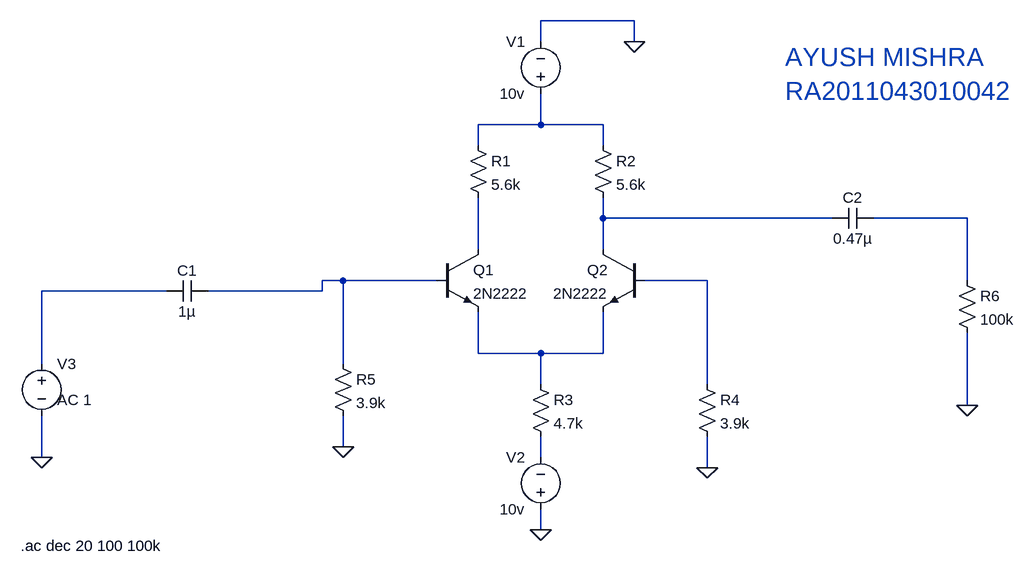
[diagram p0: schematic EXP 6x.asc]
EXP 6x.asc, the LTspice schematic file:
Version 4
SHEET 1 1444 680
WIRE 400 -224 256 -224
WIRE 256 -192 256 -224
WIRE 400 -192 400 -224
WIRE 256 -64 256 -112
WIRE 256 -64 160 -64
WIRE 352 -64 256 -64
WIRE 160 -32 160 -64
WIRE 352 -32 352 -64
WIRE 352 80 352 48
WIRE 704 80 352 80
WIRE 912 80 768 80
WIRE 160 128 160 48
WIRE 352 128 352 80
WIRE -48 176 -80 176
WIRE 96 176 -48 176
WIRE 512 176 416 176
WIRE 912 176 912 80
WIRE -320 192 -512 192
WIRE -80 192 -80 176
WIRE -80 192 -256 192
WIRE 160 288 160 224
WIRE 256 288 160 288
WIRE 352 288 352 224
WIRE 352 288 256 288
WIRE -512 304 -512 192
WIRE -48 304 -48 176
WIRE 256 336 256 288
WIRE 512 336 512 176
WIRE 912 368 912 256
WIRE -48 432 -48 384
WIRE -512 448 -512 384
WIRE 256 448 256 416
WIRE 512 464 512 416
WIRE 256 560 256 528
FLAG 400 -192 0
FLAG 256 560 0
FLAG -48 432 0
FLAG 512 464 0
FLAG -512 448 0
FLAG 912 368 0
SYMBOL npn 96 128 R0
SYMATTR InstName Q1
SYMATTR Value 2N2222
SYMBOL npn 416 128 M0
SYMATTR InstName Q2
SYMATTR Value 2N2222
SYMBOL res 144 -48 R0
SYMATTR InstName R1
SYMATTR Value 5.6k
SYMBOL res 336 -48 R0
SYMATTR InstName R2
SYMATTR Value 5.6k
SYMBOL res 240 320 R0
SYMATTR InstName R3
SYMATTR Value 4.7k
SYMBOL voltage 256 -96 R180
WINDOW 0 24 96 Left 2
WINDOW 3 24 16 Left 2
SYMATTR InstName V1
SYMATTR Value 10v
SYMBOL voltage 256 544 R180
WINDOW 0 24 96 Left 2
WINDOW 3 24 16 Left 2
WINDOW 123 0 0 Left 0
WINDOW 39 0 0 Left 0
SYMATTR InstName V2
SYMATTR Value 10v
SYMBOL res 496 320 R0
SYMATTR InstName R4
SYMATTR Value 3.9k
SYMBOL res -64 288 R0
SYMATTR InstName R5
SYMATTR Value 3.9k
SYMBOL cap -256 176 R90
WINDOW 0 0 32 VBottom 2
WINDOW 3 32 32 VTop 2
SYMATTR InstName C1
SYMATTR Value 1µ
SYMBOL voltage -512 288 R0
WINDOW 3 24 44 Left 2
WINDOW 123 24 72 Left 2
WINDOW 39 0 0 Left 0
SYMATTR Value ""
SYMATTR Value2 AC 1
SYMATTR InstName V3
SYMBOL cap 768 64 R90
WINDOW 0 0 32 VBottom 2
WINDOW 3 32 32 VTop 2
SYMATTR InstName C2
SYMATTR Value 0.47µ
SYMBOL res 896 160 R0
SYMATTR InstName R6
SYMATTR Value 100k
TEXT -544 584 Left 2 !.ac dec 20 100 100k
TEXT 632 -168 Left 4 ;AYUSH MISHRA\nRA2011043010042

The netlist it stands for:
* EXP 6x.asc
Q1 N004 N005 N008 0 2N2222
Q2 N002 N006 N008 0 2N2222
R1 N001 N004 5.6k
R2 N001 N002 5.6k
R3 N008 N009 4.7k
V1 N001 0 10v
V2 0 N009 10v
R4 N006 0 3.9k
R5 N005 0 3.9k
C1 N005 N007 1µ
V3 N007 0 AC 1
C2 N003 N002 0.47µ
R6 N003 0 100k
.model NPN NPN
.model PNP PNP
.lib standard.bjt
.ac dec 20 100 100k
* AYUSH MISHRA
* RA2011043010042
.backanno
.end